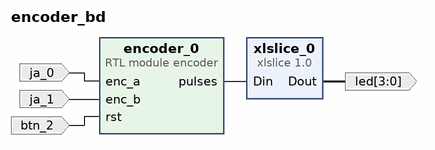
[diagram p0: block diagram of the top level]
# Vivado block design encoder_bd, xc7z020clg400-1, Vivado 2023.2
create_bd_design encoder_bd

create_bd_port -dir O -from 3 -to 0 led
create_bd_port -dir I ja_0
create_bd_port -dir I ja_1
create_bd_port -dir I -type rst btn_2

create_bd_cell -type module -reference encoder encoder_0
create_bd_cell -type ip -vlnv xilinx.com:ip:xlslice:1.0 xlslice_0
set_property -dict {CONFIG.DIN_FROM 8 CONFIG.DIN_TO 5 CONFIG.DIN_WIDTH 9} [get_bd_cells xlslice_0]

# ---- connections ----

connect_bd_net -net enc_a_0_1 [get_bd_ports ja_0] [get_bd_pins encoder_0/enc_a]
connect_bd_net -net enc_b_0_1 [get_bd_ports ja_1] [get_bd_pins encoder_0/enc_b]
connect_bd_net [get_bd_pins encoder_0/pulses] [get_bd_pins xlslice_0/Din]
connect_bd_net -net rst_0_1 [get_bd_ports btn_2] [get_bd_pins encoder_0/rst]
connect_bd_net [get_bd_pins xlslice_0/Dout] [get_bd_ports led]

validate_bd_design
save_bd_design
